# Altium schematic sheet TailLightPrototype.SchDoc: LED prototype
size B; ProjectAuthor: Nita E, Jenny Xia; Organization: Midnight Sun Solar Rayce Car Team; Address1: University of Waterloo; Address2: 200 University Ave W; Address3: Waterloo, ON, Canada; Address4: N2L 3E9; DocumentNumber: 1; ProjectRevision: 1.0; SheetNumber: 1; SheetTotal: 4; Website: www.uwmidsun.com; ProjectName: ProjectName
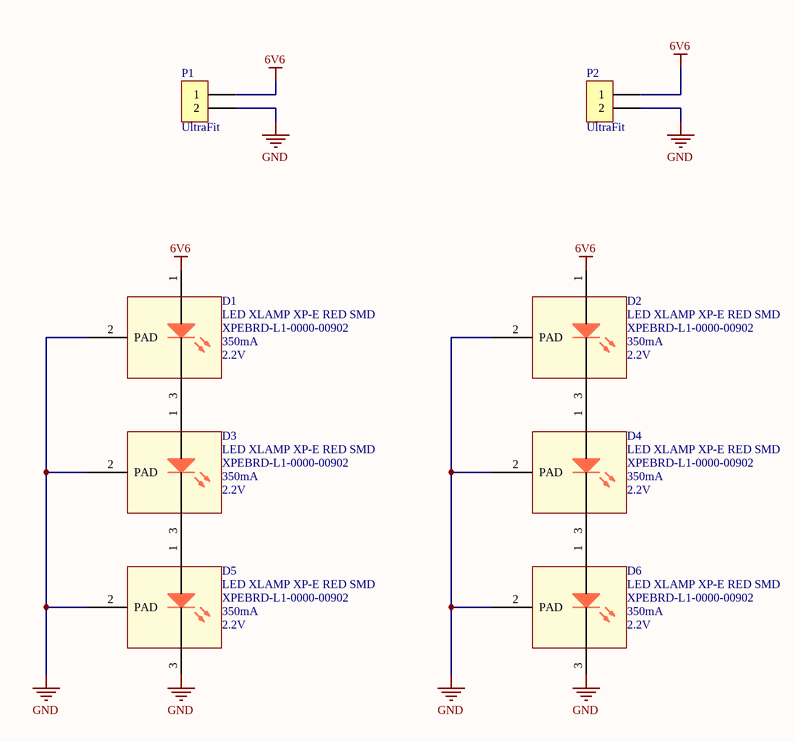
[diagram p0: TailLightPrototype.SchDoc]

## Parts
D1  LED XLAMP XP-E RED SMD  Manufacturer Part Number: XPEBRD-L1-0000-00902  Test Current: 350mA  Forward Voltage: 2.2V  [LED CREE XP-E2 1414 2-SMD]
D2  LED XLAMP XP-E RED SMD  Manufacturer Part Number: XPEBRD-L1-0000-00902  Test Current: 350mA  Forward Voltage: 2.2V  [LED CREE XP-E2 1414 2-SMD]
D3  LED XLAMP XP-E RED SMD  Manufacturer Part Number: XPEBRD-L1-0000-00902  Test Current: 350mA  Forward Voltage: 2.2V  [LED CREE XP-E2 1414 2-SMD]
D4  LED XLAMP XP-E RED SMD  Manufacturer Part Number: XPEBRD-L1-0000-00902  Test Current: 350mA  Forward Voltage: 2.2V  [LED CREE XP-E2 1414 2-SMD]
D5  LED XLAMP XP-E RED SMD  Manufacturer Part Number: XPEBRD-L1-0000-00902  Test Current: 350mA  Forward Voltage: 2.2V  [LED CREE XP-E2 1414 2-SMD]
D6  LED XLAMP XP-E RED SMD  Manufacturer Part Number: XPEBRD-L1-0000-00902  Test Current: 350mA  Forward Voltage: 2.2V  [LED CREE XP-E2 1414 2-SMD]
P1  Series: UltraFit  [CONN, 2POS ULTRA-FIT]  (hidden comment: CONN 2POS ULTRA-FIT 0.138")
P2  Series: UltraFit  [CONN, 2POS ULTRA-FIT]  (hidden comment: CONN 2POS ULTRA-FIT 0.138")

## Nets
6V6: D1.1(A) D2.1(A) P1.1 P2.1
GND: D1.2(PAD) D2.2(PAD) D3.2(PAD) D4.2(PAD) D5.2(PAD) D5.3(K) D6.2(PAD) D6.3(K) P1.2 P2.2
NetD1_3: D1.3(K) D3.1(A)
NetD2_3: D2.3(K) D4.1(A)
NetD3_3: D3.3(K) D5.1(A)
NetD4_3: D4.3(K) D6.1(A)

## Notes on the sheet
- PROJECT
- DOCUMENT
- DRAWN BY
- LAST MODIFIED
- PART NUMBER
- REVISION
- SHEET
- VARIANT
- OF
- Engineering 5 - 1002
  University of Waterloo
  (519) 888-4567 x32978
  hardware@uwmidsun.com

## Library data of the parts
D1-D6 = LED XLAMP XP-E RED SMD: LED Lighting Color XLamp® XP-E2 Red 623nm (620nm ~ 625nm) 1414 (3535 Metric); Manufacturer: Cree; Max Current Rating: 1A; Test Temperature: 25°C; Viewing Angle: 130°; Thermal Resistance of Package: 5°C/W; Supplier 1: Digi-Key; Stock 1: 1640; Pricing 1: 1 = 2.00000, 10 = 1.90000, 100 = 1.69980, 250 = 1.54584, 500 = 1.44786 (USD); Mount: Surface Mount; Case/Package: SMD/SMT; Color: Red; Packaging: Tape and Reel; Wavelength: 625nm; Lead Free: Lead Free; Supplier Part Number 1: XPEBRD-L1-0000-00902CT-ND; RoHS: Yes
P1 P2 = CONN 2POS ULTRA-FIT 0.138": 2 Positions Header, Shrouded Connector 0.138" (3.50mm) Through Hole Gold; Manufacturer 1: Molex, LLC; Manufacturer Part Number 1: 1722861302; Style: Board to Board or Cable; Shrouding: Shrouded - 4 Wall; Number of Positions: 2; Number of Positions Loaded: All; Contact Length - Post: 0.126" (3.20mm); Material Flammability Rating: UL94 V-0; Mated Stacking Heights: 26.99mm; Voltage: 400V; Supplier 1: Digi-Key; Supplier Part Number 1: WM11673-ND; Packaging: Tray; Part Status: Active; Connector Type: Header; Contact Type: Male Pin; Pitch - Mating: 0.138" (3.50mm); Number of Rows: 1; Row Spacing - Mating: -; Mounting Type: Through Hole; Termination: Kinked Pin, Solder; Fastening Type: Latch Holder; Contact Length - Mating: -; Overall Contact Length: -; Insulation Height: 0.465" (11.80mm); Contact Shape: Square; Contact Finish - Mating: Gold; Contact Finish Thickness - Mating: 30µin (0.76µm); Contact Finish - Post: Tin; Contact Material: Copper Alloy; Insulation Material: Liquid Crystal Polymer (LCP); Operating Temperature: -40°C ~ 120°C; Ingress Protection: -; Insulation Color: Black; Current Rating: -; Contact Finish Thickness - Post: 60µin (1.52µm); ComponentLink1URL: http://www.molex.com/pdm_docs/sd/1722861302_sd.pdf; ComponentLink1Description: http://www.molex.com/pdm_docs/sd/1722861302_sd.pdf